# Altium schematic sheet Sheet10.SchDoc
size A3
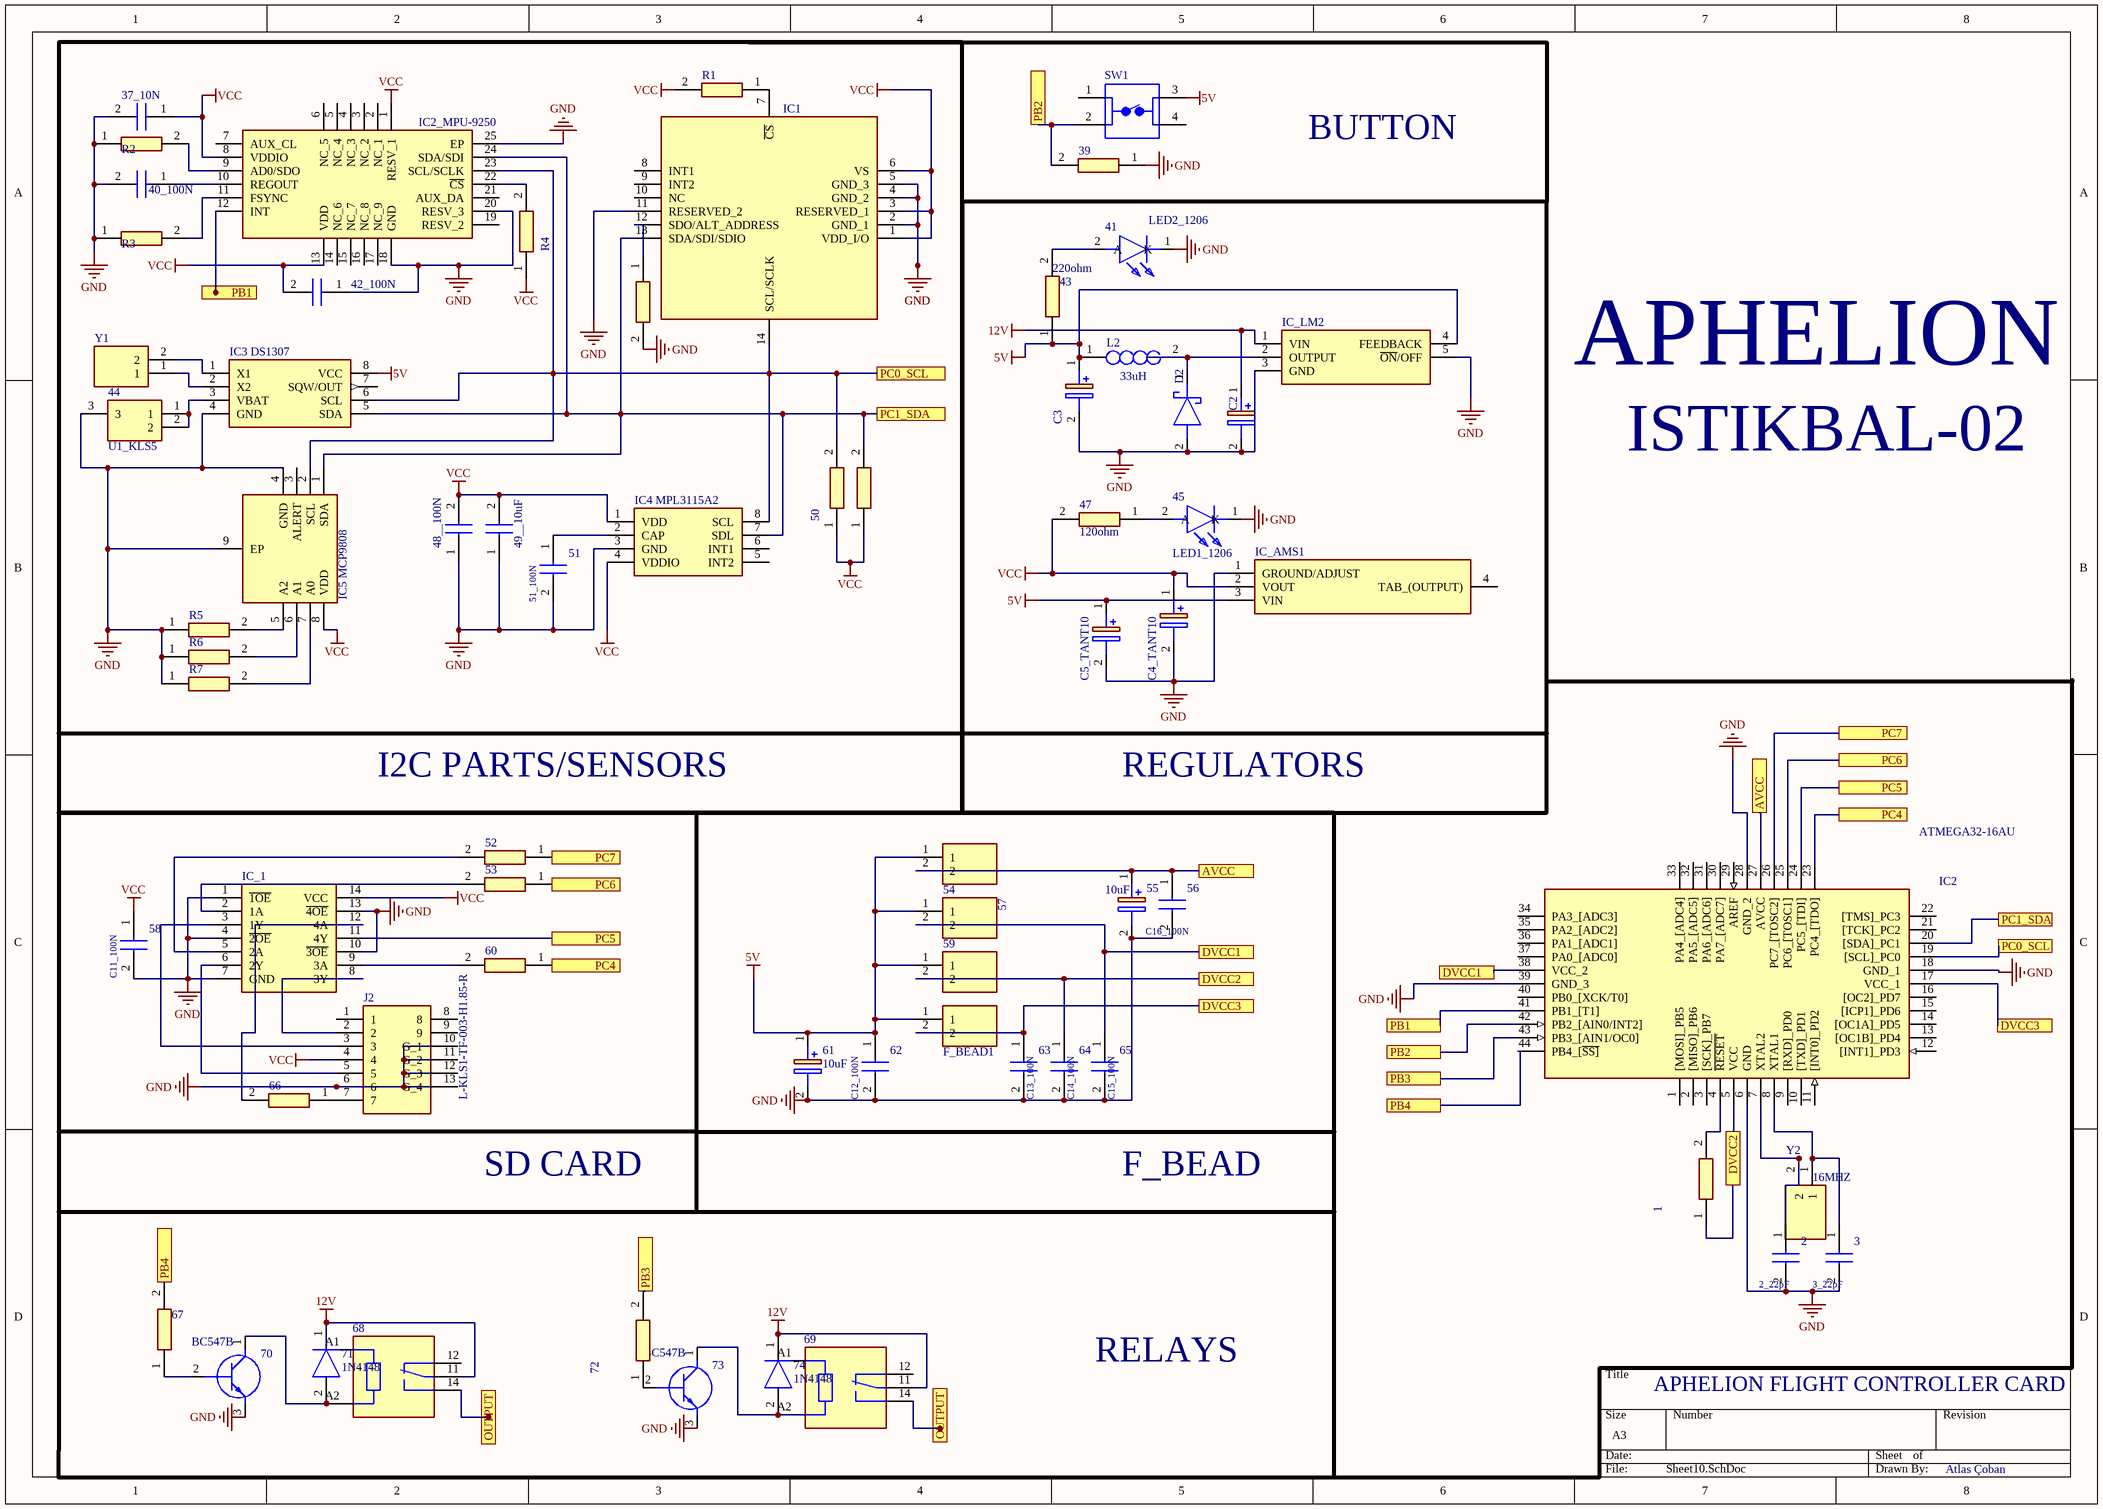
[diagram p0: Sheet10.SchDoc]

## Parts
1  (no value)  [RESC3116X65N]
2  2_22pF  [CAPC3216X100N]
3  3_22pF  [CAPC3216X100N]
37  37_10N  [CAPC3216X180N]
38  IC2_MPU-9250  [QFN40P300X300X105-25N-D]
39  (no value)  [RESC3116X65N]
40  40_100N  [CAPC3216X180N]
41  LED2_1206  [LEDC3216X130N]
42  42_100N  [CAPC3216X180N]
43  220ohm  [RESC3216X70N]
44  U1_KLS5  [KLS5CR203204]
45  LED1_1206  [LEDC3216X130N]
46  (no value)  [RESC3116X65N]
47  120ohm  [RESC3216X70N]
48  48__100N  [CAPC3216X100N]
49  49__10uF  [CAPC3216X180N]
50  (no value)  [RESC3116X65N]
51  51_100N  [CAPC3216X100N]
52  (no value)  [RESC3216X70N]
53  (no value)  [RESC3216X70N]
54  (no value)  [BEADC3216X180N]
55  10uF  [CAPPRD200W50D525H1250]
56  C16_100N  [CAPC3216X100N]
57  (no value)  [BEADC3216X180N]
58  C11_100N  [CAPC3216X100N]
59  (no value)  [BEADC3216X180N]
60  (no value)  [RESC3216X70N]
61  10uF  [CAPPRD200W50D525H1250]
62  C12_100N  [CAPC3216X100N]
63  C13_100N  [CAPC3216X100N]
64  C14_100N  [CAPC3216X100N]
65  C15_100N  [CAPC3216X100N]
66  (no value)  [RESC3216X70N]
67  (no value)  [RESC3116X65N]
68  (no value)  [TE_1393236-2]
69  (no value)  [TE_1393236-2]
70  BC547B  [TO127P419X482X1041-3P]
71  1N4148  [DIOAD1068W53L380D172]
72  (no value)  [RESC3116X65N]
73  BC547B  [TO127P419X482X1041-3P]
74  1N4148  [DIOAD1068W53L380D172]
?  (no value)  [RESC3116X65N]
C2  (no value)  [CAPPRD500W60D1275H2200]
C3  (no value)  [CAPPRD500W65D1250H2200]
C4  C4_TANT10  [CAPPM3528X210N]
C5  C5_TANT10  [CAPPM3528X210N]
D2  (no value)  [SODFL4725X110N]
F_BEAD1  (no value)  [BEADC3216X180N]
IC1  (no value)  [CC-14-1]
IC2  ATMEGA32-16AU  [QFP80P1200X1200X120-44N]
IC3_DS1307  (no value)  [SOIC127P600X175-8N]
IC4_MPL3115A2  (no value)  [MPL3115A2R1]
IC5_MCP9808  (no value)  [SON50P300X200X100-9N-D]
IC_1  (no value)  [SON65P440X500X110-14N]
IC_AMS1  (no value)  [SOT229P700X180-4N]
IC_LM2  (no value)  [TO170P470X1028X2142-5P]
J2  L-KLS1-TF-003-H1.85-R  [L-KLS1-TF-003-H1.85-R]
L2  33uH  [INDPM6063X300N]
R1  (no value)  [RESC3116X65N]
R2  (no value)  [RESC3116X65N]
R3  (no value)  [RESC3116X65N]
R4  (no value)  [RESC3116X65N]
R5  (no value)  [RESC3116X65N]
R6  (no value)  [RESC3116X65N]
R7  (no value)  [RESC3116X65N]
SW1  (no value)  [TE_3-1825910-1]
Y1  (no value)  [NC26LF-327]
Y2  16MHZ  [NX5032GA16MHZSTDCSK4]

## Blocks framed on the sheet
I2C PARTS/SENSORS: 37 38 40 42 44 46 48-51 ? IC1 IC3_DS1307 IC4_MPL3115A2 IC5_MCP9808 R1-R7 Y1
REGULATORS: 41 43 45 47 C2-C5 D2 IC_AMS1 IC_LM2 L2
F_BEAD: 54-57 59 61-65 F_BEAD1

## Ports
AVCC, DVCC1, DVCC2, DVCC3, OUTPUT, PB1, PB2, PB3, PB4, PC0_SCL, PC1_SDA, PC4, PC5, PC6, PC7

## Nets
5V: 43.1 54.1 57.1 59.1 61.1(+) 62.1 C3.1(+) C5.1(+) F_BEAD1.1 IC3_DS1307.8(VCC) IC_AMS1.3(VIN) IC_LM2.4(FEEDBACK) L2.1 SW1.3
12V: 68.11 68.A1 69.11 71.1(K) 74.1(K) C2.1(+) IC_LM2.1(VIN)
GND: 2.2 3.2 37.2 38.18(GND) 38.20(RESV_3) 38.25(EP) 39.1 40.2 41.1(K) 42.1 44.3 45.1(K) 48.1 49.1 51.2 55.2(-) 56.2 58.2 61.2(-) 62.2 63.2 64.2 65.2 70.3(E) 73.3(E) ?.2 C2.2(-) C3.2(-) C4.2(-) C5.2(-) D2.2(A) IC1.2(GND_1) IC1.4(GND_2) IC1.5(GND_3) IC1.11(RESERVED_2) IC2.6(GND) IC2.18(GND_1) IC2.28(GND_2) IC2.39(GND_3) IC3_DS1307.4(GND) IC4_MPL3115A2.3(GND) IC5_MCP9808.4(GND) IC5_MCP9808.9(EP) IC_1.1(~{1OE}) IC_1.4(~{2OE}) IC_1.7(GND) IC_1.10(~{3OE}) IC_1.13(~{4OE}) IC_AMS1.1(GROUND/ADJUST) IC_LM2.3(GND) IC_LM2.5(~{ON}/OFF) J2.6 R2.1 R3.1 R5.1 R6.1 R7.1
VCC: 37.1 38.1(RESV_1) 38.8(VDDIO) 38.13(VDD) 42.2 46.1 47.2 48.2 49.2 50.1 58.1 C4.1(+) IC1.1(VDD_I/O) IC1.3(RESERVED_1) IC1.6(VS) IC4_MPL3115A2.1(VDD) IC4_MPL3115A2.4(VDDIO) IC5_MCP9808.8(VDD) IC_1.14(VCC) IC_AMS1.2(VOUT) J2.4 R1.2 R4.1
AVCC: 55.1(+) 56.1 57.2 IC2.27(AVCC) ; port AVCC
DVCC1: 54.2 65.1 IC2.38(VCC_2) ; port DVCC1
DVCC2: 1.1 59.2 64.1 IC2.5(VCC) ; port DVCC2
DVCC3: 63.1 F_BEAD1.2 IC2.17(VCC_1) ; port DVCC3
PB1: IC2.41(PB1_[T1]) ; port PB1
PB2: 39.2 IC2.42(PB2_[AIN0/INT2]) SW1.2 ; port PB2
PB3: 72.2 IC2.43(PB3_[AIN1/OC0]) ; port PB3
PB4: 67.2 IC2.44(PB4_[~{SS]}) ; port PB4
PC0_SCL: 38.23(SCL/SCLK) 46.2 IC1.14(SCL/SCLK) IC2.19([SCL]_PC0) IC3_DS1307.6(SCL) IC4_MPL3115A2.8(SCL) IC5_MCP9808.2(SCL) ; port PC0_SCL
PC1_SDA: 38.24(SDA/SDI) 50.2 IC1.13(SDA/SDI/SDIO) IC2.20([SDA]_PC1) IC3_DS1307.5(SDA) IC4_MPL3115A2.7(SDL) IC5_MCP9808.1(SDA) ; port PC1_SDA
PC4: 60.1 IC2.23(PC4_[TDO]) ; port PC4
PC5: IC2.24(PC5_[TDI]) IC_1.11(4Y) ; port PC5
PC6: 53.1 IC2.25(PC6_[TOSC1]) ; port PC6
PC7: 52.1 IC2.26(PC7_[TOSC2]) ; port PC7
Net1_2: 1.2 IC2.4(~{RESET})
Net2_1: 2.1 IC2.7(XTAL2) Y2.2
Net3_1: 3.1 IC2.8(XTAL1) Y2.1
Net38_9: 38.9(AD0/SDO) R2.2
Net38_10: 38.10(REGOUT) 40.1
Net38_11: 38.11(FSYNC) R3.2
Net38_22: 38.22(~{CS}) R4.2
Net41_2: 41.2(A) 43.2
Net44_1: 44.1 44.2 IC3_DS1307.3(VBAT)
Net45_2: 45.2(A) 47.1
Net51_1: 51.1 IC4_MPL3115A2.2(CAP)
Net52_2: 52.2 IC_1.5(2A)
Net53_2: 53.2 IC_1.2(1A)
Net60_2: 60.2 IC_1.9(3A)
Net66_1: 66.1 J2.7
Net66_2: 66.2 IC_1.12(4A)
Net67_1: 67.1 70.2(B)
Net68_A2: 68.A2 70.1(C) 71.2(A)
Net69_A2: 69.A2 73.1(C) 74.2(A)
Net72_1: 72.1 73.2(B)
Net?_1: ?.1 IC1.12(SDO/ALT_ADDRESS)
NetD2_1: D2.1(K) IC_LM2.2(OUTPUT) L2.2
NetIC1_7: IC1.7(~{CS}) R1.1
NetIC3_DS1307_1: IC3_DS1307.1(X1) Y1.2
NetIC3_DS1307_2: IC3_DS1307.2(X2) Y1.1
NetIC5_MCP9808_5: IC5_MCP9808.5(A2) R5.2
NetIC5_MCP9808_6: IC5_MCP9808.6(A1) R6.2
NetIC5_MCP9808_7: IC5_MCP9808.7(A0) R7.2
NetIC_1_3: IC_1.3(1Y) J2.3
NetIC_1_6: IC_1.6(2Y) J2.5
NetIC_1_8: IC_1.8(3Y) J2.2

Not connected (* = marked no-connect by the designer): 38 2(NC_1) 3(NC_2) 4(NC_3) 5(NC_4) 6(NC_5) 7(AUX_CL) 12(INT) 14(NC_6) 15(NC_7) 16(NC_8) 17(NC_9) 19(RESV_2) 21(AUX_DA); 68 12 14; 69 12 14 A1; IC1 8(INT1) 9(INT2) 10(NC); IC2 1([MOSI]_PB5) 2([MISO]_PB6) 3([SCK]_PB7) 9([RXD]_PD0) 10([TXD]_PD1) 11([INT0]_PD2) 12([INT1]_PD3) 13([OC1B]_PD4) 14([OC1A]_PD5) 15([ICP1]_PD6) 16([OC2]_PD7) 21([TCK]_PC2) 22([TMS]_PC3) 29(AREF) 30(PA7_[ADC7]) 31(PA6_[ADC6]) 32(PA5_[ADC5]) 33(PA4_[ADC4]) 34(PA3_[ADC3]) 35(PA2_[ADC2]) 36(PA1_[ADC1]) 37(PA0_[ADC0]) 40(PB0_[XCK/T0]); IC3_DS1307 7(SQW/OUT); IC4_MPL3115A2 5(INT2) 6(INT1); IC5_MCP9808 3(ALERT); IC_AMS1 4(TAB_(OUTPUT)); J2 1 8 9 10(G_1) 11(G_2) 12(G_3) 13(G_4); SW1 1 4

## Notes on the sheet
- BUTTON
- APHELION
- ISTIKBAL-02
- SD CARD
- RELAYS
- APHELION FLIGHT CONTROLLER CARD
- Atlas Çoban

## Library data of the parts
1 39 46 50 67 72 ? R1-R7 = MC1206S4F5600T5E: Resistor; Manufacturer_Name: MULTICOMP; Datasheet Link: http://www.newark.com/pdfs/datasheets/spc/TA-677.pdf?_ga=1.248182791.1411154270.1472651675; Height: 0.65mm; Manufacturer_Part_Number: MC1206S4F5600T5E
2 3 48 51 56 58 62-65 = CL31B104KBCNNNC: Capacitor; Manufacturer_Name: Samsung Electro-Mechanics; Datasheet Link: http://www.samsungsem.com/kr/support/product-search/mlcc/CL31B104KBCNNNC.jsp; Height: 1mm; Manufacturer_Part_Number: CL31B104KBCNNNC; RS Part Number: 7666947; RS Price/Stock: http://uk.rs-online.com/web/p/products/7666947
37 40 42 49 = CL31A106KBHNNNE: Capacitor; Manufacturer_Name: Samsung Electro-Mechanics; Datasheet Link: http://www.samsungsem.com/kr/support/product-search/mlcc/__icsFiles/afieldfile/2016/08/18/S_CL31A106KBHNNNE.pdf; Height: 1.8mm; Manufacturer_Part_Number: CL31A106KBHNNNE; Mouser Part Number: N/A; Mouser Price/Stock: https://www.mouser.com/Search/Refine.aspx?Keyword=N%2FA
38 = MPU-9250: Integrated Circuit; Manufacturer_Name: InvenSense Inc.; Datasheet Link: https://store.invensense.com/datasheets/invensense/MPU9250REV1.0.pdf; Height: 1.05mm; Manufacturer_Part_Number: MPU-9250; Mouser Part Number: 410-MPU-9250; Mouser Price/Stock: https://www.mouser.com/Search/Refine.aspx?Keyword=410-MPU-9250; RS Part Number: 8837942P; RS Price/Stock: http://uk.rs-online.com/web/p/products/8837942P
41 45 = QTLP650C2TR: LED; Manufacturer_Name: Everlight; Datasheet Link: https://media.digikey.com/pdf/Data%20Sheets/Everlight%20PDFs/QTLP650(C,D)-2,3,4,7,B.pdf; Height: 1.3mm; Manufacturer_Part_Number: QTLP650C2TR; Mouser Part Number: 638-QTLP650C2; Mouser Price/Stock: https://www.mouser.com/Search/Refine.aspx?Keyword=638-QTLP650C2
43 47 52 53 60 66 = ERJ-U08F2200V: Resistor; Manufacturer_Name: Panasonic; Datasheet Link: http://uk.rs-online.com/web/p/products/1724351; Height: 0.7mm; Manufacturer_Part_Number: ERJ-U08F2200V; Mouser Part Number: 667-ERJ-U08F2200V; Mouser Price/Stock: https://www.mouser.com/Search/Refine.aspx?Keyword=667-ERJ-U08F2200V
44 = KLS5-CR2032-04: Undefined or Miscellaneous; Manufacturer_Name: KLS Electronic; Datasheet Link: http://www.klsele.com/admin/product_upload/20151124101114KLS5-CR2032-04.pdf; Height: 18.13mm; Manufacturer_Part_Number: KLS5-CR2032-04
54 57 59 F_BEAD1 = BLM31KN601BH1L: Filter; Manufacturer_Name: Murata Electronics; Datasheet Link: https://www.murata.com/en-us/products/productdetail?partno=BLM31KN601BH1%23; Height: 1.8mm; Manufacturer_Part_Number: BLM31KN601BH1L; Mouser Part Number: 81-BLM31KN601BH1L; Mouser Price/Stock: https://www.mouser.com/Search/Refine.aspx?Keyword=81-BLM31KN601BH1L
55 61 = UHE1H100MDD1TD: Capacitor Polarised; Manufacturer_Name: Nichicon; Datasheet Link: http://nichicon-us.com/english/products/pdfs/e-uhe.pdf; Height: 12.5mm; Manufacturer_Part_Number: UHE1H100MDD1TD; Mouser Part Number: 647-UHE1H100MDD1TD; Mouser Price/Stock: https://www.mouser.com/Search/Refine.aspx?Keyword=647-UHE1H100MDD1TD
68 69 = 1393236-2: General Purpose Relay SPDT _1 Form C_ 5VDC Coil Through Hole; MP: V23092A1005A301; MF: TE Connectivity Potter & Brumfield Relays; Value: *; SnapEDA_Link: https://www.snapeda.com/parts/V23092A1005A301/TE%20Connectivity%20Potter%20%26%20Brumfield%20Relays/view-part/3077866/?ref=snap; Availability: Unavailable; Package: None; TE_purchase_URL: https://www.te.com/usa-en/product-1393236-2.html?te_bu=Cor&te_type=disp&te_campaign=seda_glo_cor-seda-global-disp-prtnr-fy19-seda-model-bom-cta_sma-317_1&elqCampaignId=32493; Price: None
70 73 = BC547B: Transistor BJT NPN; Manufacturer_Name: ON Semiconductor; Datasheet Link: http://www.onsemi.com/pub/Collateral/BC546-D.PDF; Height: 4.19mm; Manufacturer_Part_Number: BC547B; Mouser Part Number: 512-BC547B; Mouser Price/Stock: https://www.mouser.com/Search/Refine.aspx?Keyword=512-BC547B; RS Part Number: 7619828P; RS Price/Stock: http://uk.rs-online.com/web/p/products/7619828P
71 74 = 1N4148: Diode; Manufacturer_Name: Micro Commercial Components (MCC); Datasheet Link: https://componentsearchengine.com/Datasheets/1/1N4148.pdf; Manufacturer_Part_Number: 1N4148; Mouser Part Number: 833-1N4148; Mouser Price/Stock: https://www.mouser.com/Search/Refine.aspx?Keyword=833-1N4148
C2 = UPW1V681MHD: Capacitor Polarised; Manufacturer_Name: Nichicon; Allied_Number: 70187400; Datasheet Link: http://nichicon-us.com/english/products/pdfs/e-upw.pdf; Height: 22mm; Manufacturer_Part_Number: UPW1V681MHD; Mouser Part Number: 647-UPW1V681MHD; Mouser Price/Stock: https://www.mouser.com/Search/Refine.aspx?Keyword=647-UPW1V681MHD; RS Part Number: 7152776P; RS Price/Stock: http://uk.rs-online.com/web/p/products/7152776P; Allied Price/Stock: https://www.alliedelec.com/nichicon-upw1v681mhd/70187400/
C3 = EEU-FC1J221S: Capacitor Polarised; Manufacturer_Name: Panasonic; Datasheet Link: http://uk.rs-online.com/web/p/products/6283835; Height: 22mm; Manufacturer_Part_Number: EEU-FC1J221S; Mouser Part Number: 667-EEU-FC1J221S; Mouser Price/Stock: https://www.mouser.com/Search/Refine.aspx?Keyword=667-EEU-FC1J221S
C4 C5 = TAJB106M025RNJ: Capacitor Polarised; Manufacturer_Name: AVX; Datasheet Link: http://datasheets.avx.com/TAJ.pdf; Height: 2.1mm; Manufacturer_Part_Number: TAJB106M025RNJ; Mouser Part Number: 581-TAJB106M025RNJ; Mouser Price/Stock: https://www.mouser.com/Search/Refine.aspx?Keyword=581-TAJB106M025RNJ
D2 = VSS8D5M10-M3_H: Schottky Diode; Manufacturer_Name: Vishay; Manufacturer_Part_Number: VSS8D5M10-M3/H; Datasheet Link: https://componentsearchengine.com/Datasheets/1/VSS8D5M10-M3_H.pdf; Height: 1.1mm; Mouser Part Number: 78-VSS8D5M10-M3/H; Mouser Price/Stock: https://www.mouser.com/Search/Refine.aspx?Keyword=78-VSS8D5M10-M3%2FH
IC1 = ADXL345BCCZ-RL7: Accelerometer; Manufacturer_Name: Analog Devices; Datasheet Link: https://www.analog.com/media/en/technical-documentation/data-sheets/ADXL345.pdf; Manufacturer_Part_Number: ADXL345BCCZ-RL7; Mouser Part Number: 584-ADXL345BCCZ-R7; Mouser Price/Stock: https://www.mouser.com/Search/Refine.aspx?Keyword=584-ADXL345BCCZ-R7; RS Part Number: 9140413; RS Price/Stock: http://uk.rs-online.com/web/p/products/9140413
IC2 = ATMEGA32-16AU: Integrated Circuit; Manufacturer_Name: Microchip; Datasheet Link: http://docs-emea.rs-online.com/webdocs/091f/0900766b8091f466.pdf; Height: 1.2mm; Manufacturer_Part_Number: ATMEGA32-16AU; Mouser Part Number: 556-ATMEGA32-16AU; Mouser Price/Stock: https://www.mouser.com/Search/Refine.aspx?Keyword=556-ATMEGA32-16AU; RS Part Number: 6281485P; RS Price/Stock: http://uk.rs-online.com/web/p/products/6281485P
IC3_DS1307 = DS1307ZN+: Integrated Circuit; Manufacturer_Name: Maxim Integrated; Datasheet Link: https://datasheets.maximintegrated.com/en/ds/DS1307.pdf; Height: 1.75mm; Manufacturer_Part_Number: DS1307ZN+; Mouser Part Number: 700-DS1307ZN; Mouser Price/Stock: https://www.mouser.com/Search/Refine.aspx?Keyword=700-DS1307ZN; RS Part Number: 1898602P; RS Price/Stock: http://uk.rs-online.com/web/p/products/1898602P
IC4_MPL3115A2 = MPL3115A2R1: Integrated Circuit; Manufacturer_Name: NXP; Datasheet Link: http://www.nxp.com/docs/en/data-sheet/MPL3115A2.pdf; Height: 1.2mm; Manufacturer_Part_Number: MPL3115A2R1; Mouser Part Number: 841-MPL3115A2R1; Mouser Price/Stock: https://www.mouser.com/Search/Refine.aspx?Keyword=841-MPL3115A2R1
IC5_MCP9808 = MCP9808T-E_MC: Integrated Circuit; Manufacturer_Name: Microchip; Manufacturer_Part_Number: MCP9808T-E/MC; Allied_Number: 70451339; Datasheet Link: http://www.mouser.com/ds/2/268/25095A-15487.pdf; Height: 1mm; Mouser Part Number: 579-MCP9808T-E/MC; Mouser Price/Stock: https://www.mouser.com/Search/Refine.aspx?Keyword=579-MCP9808T-E%2FMC; RS Part Number: 1371041P; RS Price/Stock: http://uk.rs-online.com/web/p/products/1371041P; Allied Price/Stock: https://www.alliedelec.com/microchip-technology-inc-mcp9808t-e-mc/70451339/
IC_1 = 74LVC125APW,112: Integrated Circuit; Manufacturer_Name: Nexperia; Datasheet Link: https://assets.nexperia.com/documents/data-sheet/74LVC125A.pdf; Height: 1.1mm; Manufacturer_Part_Number: 74LVC125APW,112; Mouser Part Number: 771-LVC125APW112; Mouser Price/Stock: https://www.mouser.com/Search/Refine.aspx?Keyword=771-LVC125APW112; RS Part Number: 3559993P; RS Price/Stock: http://uk.rs-online.com/web/p/products/3559993P
IC_AMS1 = ams1117-3.3v: Integrated Circuit; Manufacturer_Name: Advanced Monolithic Systems; Datasheet Link: http://www.advanced-monolithic.com/pdf/ds1117.pdf; Height: 1.8mm; Manufacturer_Part_Number: ams1117-3.3v
IC_LM2 = LM2596T-5.0: Integrated Circuit; Manufacturer_Name: Texas Instruments; Datasheet Link: http://www.ti.com/general/docs/lit/getliterature.tsp?genericPartNumber=lm2596&fileType=pdf; Height: 4.7mm; Manufacturer_Part_Number: LM2596T-5.0; Mouser Part Number: 926-LM2596T-50; Mouser Price/Stock: https://www.mouser.com/Search/Refine.aspx?Keyword=926-LM2596T-50; RS Part Number: 3313242; RS Price/Stock: http://uk.rs-online.com/web/p/products/3313242
J2 = L-KLS1-TF-003-H1.85-R: Connector; Manufacturer_Name: KLS Electronic; Datasheet Link: https://img.ozdisan.com/ETicaret_Dosya/476392_7149645.pdf; Manufacturer_Part_Number: L-KLS1-TF-003-H1.85-R
L2 = B82462G4333M000: Inductor; Manufacturer_Name: EPCOS; Datasheet Link: https://en.tdk.eu/inf/30/db/ind_2008/b82462g4.pdf; Height: 3mm; Manufacturer_Part_Number: B82462G4333M000; Mouser Part Number: 871-B82462G4333M; Mouser Price/Stock: https://www.mouser.com/Search/Refine.aspx?Keyword=871-B82462G4333M; RS Part Number: 4958161P; RS Price/Stock: http://uk.rs-online.com/web/p/products/4958161P
SW1 = 3-1825910-1: Switch Push Button OFF _ON_ SPST Round Button 0.05A 24VDC Momentary Contact PC Pins Thru-Hole; MF: TE Connectivity; Availability: Unavailable; SnapEDA_Link: https://www.snapeda.com/parts/3-1825910-1/TE%20Connectivity%20ALCOSWITCH%20Switches/view-part/452461/?ref=snap; Price: None; EU_RoHS_Compliance: Compliant; Package: None; TE_purchase_URL: https://www.te.com/usa-en/product-3-1825910-1.html?te_bu=Cor&te_type=disp&te_campaign=seda_glo_cor-seda-global-disp-prtnr-fy19-seda-model-bom-cta_sma-317_1&elqCampaignId=32493; MP: 3-1825910-1; Value: *
Y1 = NC26LF-327: Crystal or Oscillator; Manufacturer_Name: Fox; Datasheet Link: https://componentsearchengine.com/Datasheets/2/NC26LF-327.pdf; Manufacturer_Part_Number: NC26LF-327; Mouser Part Number: 559-NC26-LF; Mouser Price/Stock: https://www.mouser.com/Search/Refine.aspx?Keyword=559-NC26-LF; RS Part Number: 5476979P; RS Price/Stock: http://uk.rs-online.com/web/p/products/5476979P
Y2 = NX5032GA-16MHZ-STD-CSK-4: Crystal or Oscillator; Manufacturer_Name: NDK; Datasheet Link: http://www.ndk.com/images/products/catalog/c_NX5032GA_e.pdf; Height: 1.5mm; Manufacturer_Part_Number: NX5032GA-16MHZ-STD-CSK-4